# Altium schematic sheet [2] - Power Budget.SchDoc
size 431 x 279 mm; SheetNumber: 2; SheetTotal: 11
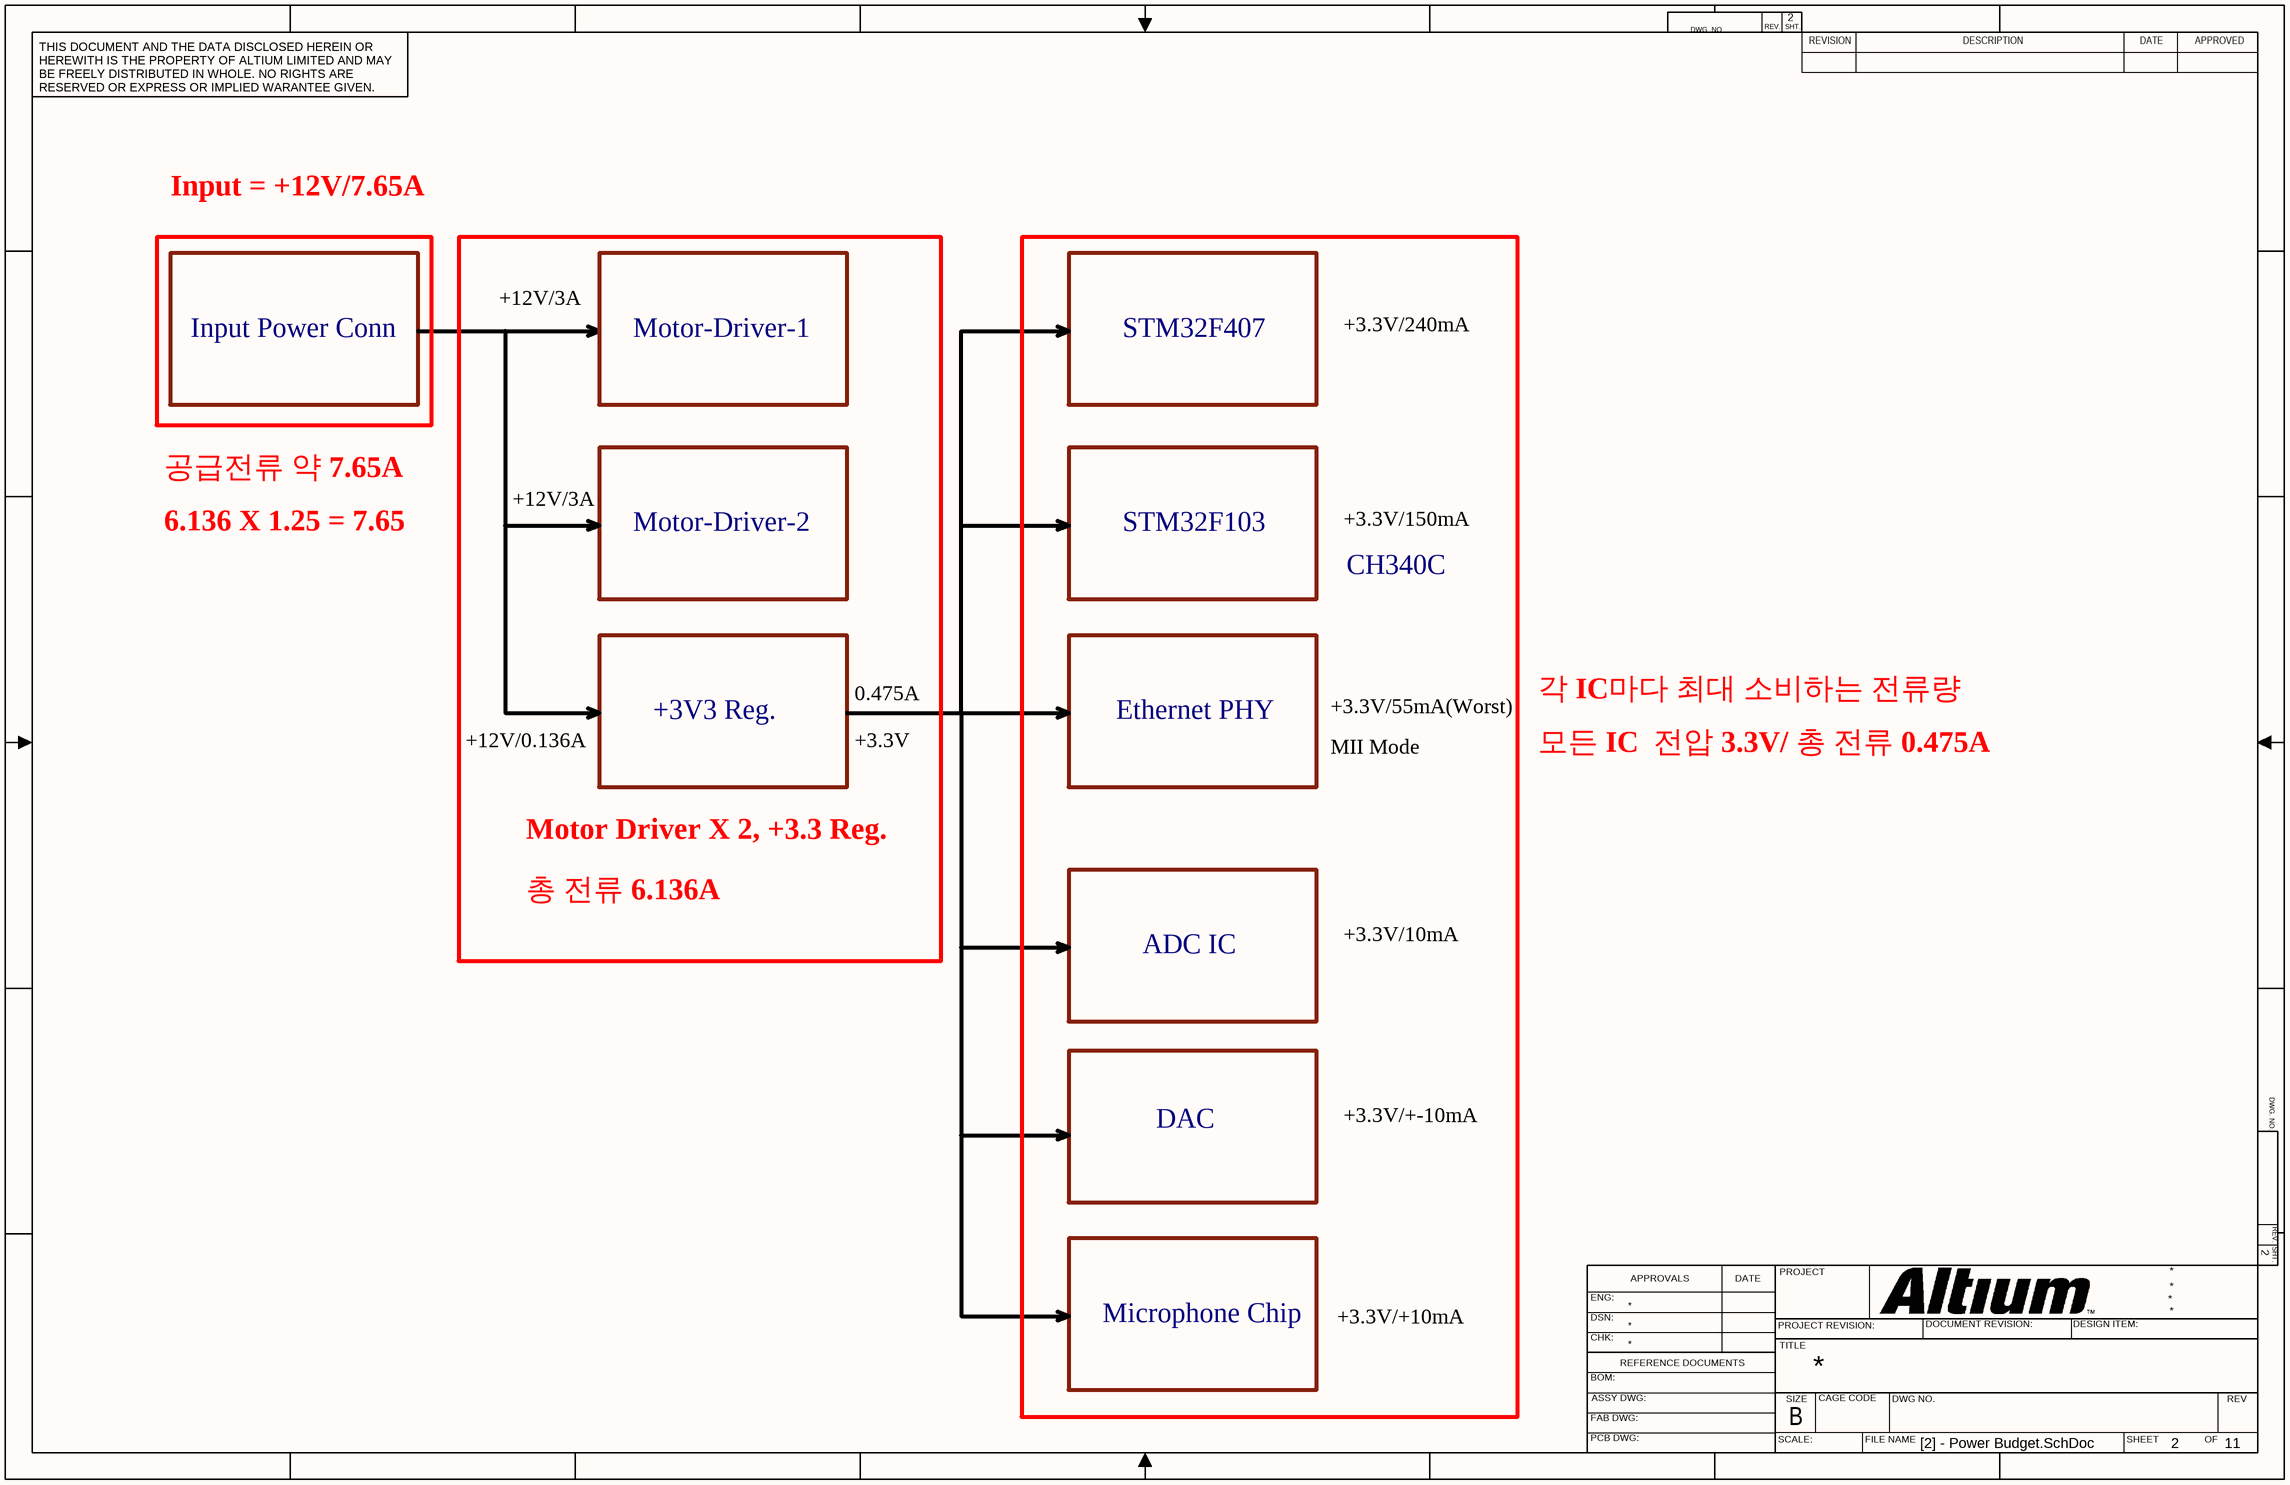
[diagram p0: [2] - Power Budget.SchDoc]

## Notes on the sheet
- Input = +12V/7.65A
- Input Power Conn
- +12V/3A
- Motor-Driver-1
- STM32F407
- +3.3V/240mA
- 공급전류 약 7.65A
- 6.136 X 1.25 = 7.65
- Motor-Driver-2
- STM32F103
- +3.3V/150mA
- CH340C
- 0.475A
- 각 IC마다 최대 소비하는 전류량
- +12V/0.136A
- +3V3 Reg.
- +3.3V
- Ethernet PHY
- +3.3V/55mA(Worst)
- MII Mode
- 모든 IC  전압 3.3V/ 총 전류 0.475A
- Motor Driver X 2, +3.3 Reg.
- 총 전류 6.136A
- ADC IC
- +3.3V/10mA
- DAC
- +3.3V/+-10mA
- Microphone Chip
- +3.3V/+10mA
- DWG. NO.
- REV.
- SHT.
- THIS DOCUMENT AND THE DATA DISCLOSED HEREIN OR HEREWITH IS THE PROPERTY OF ALTIUM LIMITED AND MAY BE FREELY DISTRIBUTED IN WHOLE. NO RIGHTS ARE RESERVED OR EXPRESS OR IMPLIED WARANTEE GIVEN.
- REVISION
- DESCRIPTION
- DATE
- APPROVED
- ENG:
- APPROVALS
- PROJECT
- DSN:
- CHK:
- REFERENCE DOCUMENTS
- PROJECT REVISION:
- TITLE
- DOCUMENT REVISION:
- DESIGN ITEM:
- BOM:
- FAB DWG:
- PCB DWG:
- ASSY DWG:
- SCALE:
- SIZE
- B
- CAGE CODE
- FILE NAME
- DWG NO.
- SHEET
- OF
- REV